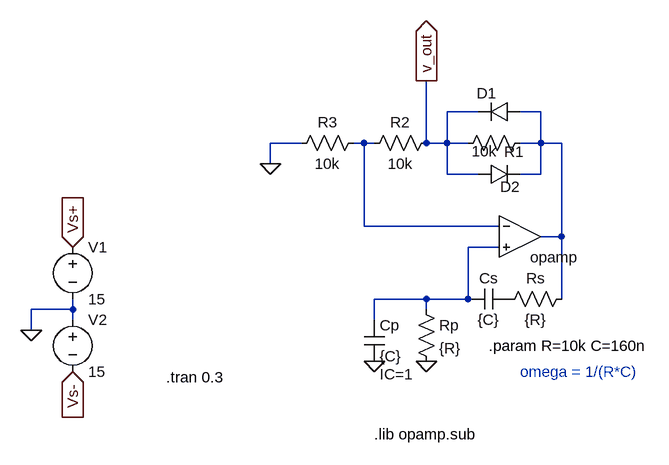
[diagram p0: schematic Wien_bridge_oscillator_2.asc]
Wien_bridge_oscillator_2.asc, the LTspice schematic file:
Version 4
SHEET 1 880 680
WIRE 160 -48 112 -48
WIRE 256 -48 224 -48
WIRE -112 0 -160 0
WIRE -16 0 -32 0
WIRE 0 0 -16 0
WIRE 80 0 80 -96
WIRE 112 0 112 -48
WIRE 112 0 80 0
WIRE 144 0 112 0
WIRE 256 0 256 -48
WIRE 256 0 224 0
WIRE 288 0 256 0
WIRE -160 32 -160 0
WIRE 112 48 112 0
WIRE 160 48 112 48
WIRE 256 48 256 0
WIRE 256 48 224 48
WIRE -16 128 -16 0
WIRE 192 128 -16 128
WIRE 288 144 288 0
WIRE 288 144 256 144
WIRE 192 160 144 160
WIRE 80 240 0 240
WIRE 144 240 144 160
WIRE 144 240 80 240
WIRE 288 240 288 144
WIRE -464 256 -464 240
WIRE -464 256 -528 256
WIRE 80 256 80 240
WIRE -464 272 -464 256
WIRE 0 272 0 240
WIRE -528 288 -528 256
FLAG 80 336 0
FLAG 0 336 0
FLAG -528 288 0
FLAG -464 352 Vs-
IOPIN -464 352 In
FLAG -464 160 Vs+
IOPIN -464 160 In
FLAG 80 -96 v_out
IOPIN 80 -96 Out
FLAG -160 32 0
SYMBOL OpAmps\\opamp 224 80 R0
WINDOW 0 0 32 Invisible 2
SYMATTR InstName U1
SYMBOL cap 208 224 R90
WINDOW 0 0 32 VBottom 2
WINDOW 3 32 32 VTop 2
SYMATTR InstName Cs
SYMATTR Value {C}
SYMBOL res 304 224 R90
WINDOW 0 0 56 VBottom 2
WINDOW 3 32 56 VTop 2
SYMATTR InstName Rs
SYMATTR Value {R}
SYMBOL res 64 240 R0
SYMATTR InstName Rp
SYMATTR Value {R}
SYMBOL cap -16 272 R0
WINDOW 39 24 84 Left 2
SYMATTR InstName Cp
SYMATTR Value {C}
SYMATTR SpiceLine IC=1
SYMBOL voltage -464 144 R0
WINDOW 123 0 0 Left 0
WINDOW 39 0 0 Left 0
SYMATTR InstName V1
SYMATTR Value 15
SYMBOL voltage -464 256 R0
WINDOW 123 0 0 Left 0
WINDOW 39 0 0 Left 0
SYMATTR InstName V2
SYMATTR Value 15
SYMBOL diode 160 64 R270
WINDOW 0 -19 49 VTop 2
WINDOW 3 0 32 Invisible 2
SYMATTR InstName D2
SYMBOL res 128 16 R270
WINDOW 0 -13 87 VTop 2
WINDOW 3 19 41 VBottom 2
SYMATTR InstName R1
SYMATTR Value 10k
SYMBOL diode 224 -64 R90
WINDOW 0 3 51 VBottom 2
WINDOW 3 32 32 Invisible 2
SYMATTR InstName D1
SYMBOL res 96 -16 R90
WINDOW 0 0 56 VBottom 2
WINDOW 3 32 56 VTop 2
SYMATTR InstName R2
SYMATTR Value 10k
SYMBOL res -16 -16 R90
WINDOW 0 0 56 VBottom 2
WINDOW 3 32 56 VTop 2
SYMATTR InstName R3
SYMATTR Value 10k
TEXT 0 448 Left 2 !.lib opamp.sub
TEXT -320 360 Left 2 !.tran 0.3
TEXT 224 352 Left 2 ;omega = 1/(R*C)
TEXT 176 312 Left 2 !.param R=10k C=160n

The netlist it stands for:
* Wien_bridge_oscillator_2.asc
XU1 N002 N003 N001 opamp Aol=100K GBW=10Meg  ; pins invin noninvin out
Cs P001 N003 {C}
Rs N001 P001 {R}
Rp N003 0 {R}
Cp N003 0 {C} IC=1
V1 Vs+ 0 15
V2 0 Vs- 15
D2 v_out N001 D
R1 v_out N001 10k
D1 N001 v_out D
R2 v_out N002 10k
R3 N002 0 10k
.model D D
.lib standard.dio
.lib opamp.sub
.tran 0.3
* omega = 1/(R*C)
.param R=10k C=160n
.backanno
.end